# Altium project AMC_uBACKPLANE.PrjPcb (part 4 of 4)

## Sheet I2C_SW.SchDoc: I2C SW
size 420 x 297 mm; Organization: Altium Limited; Address1: L3, 12a Rodborough Rd; Address2: Frenchs Forest; Address3: NSW; Address4: Australia 2086; DocumentNumber: 14; SheetNumber: 15; SheetTotal: 15
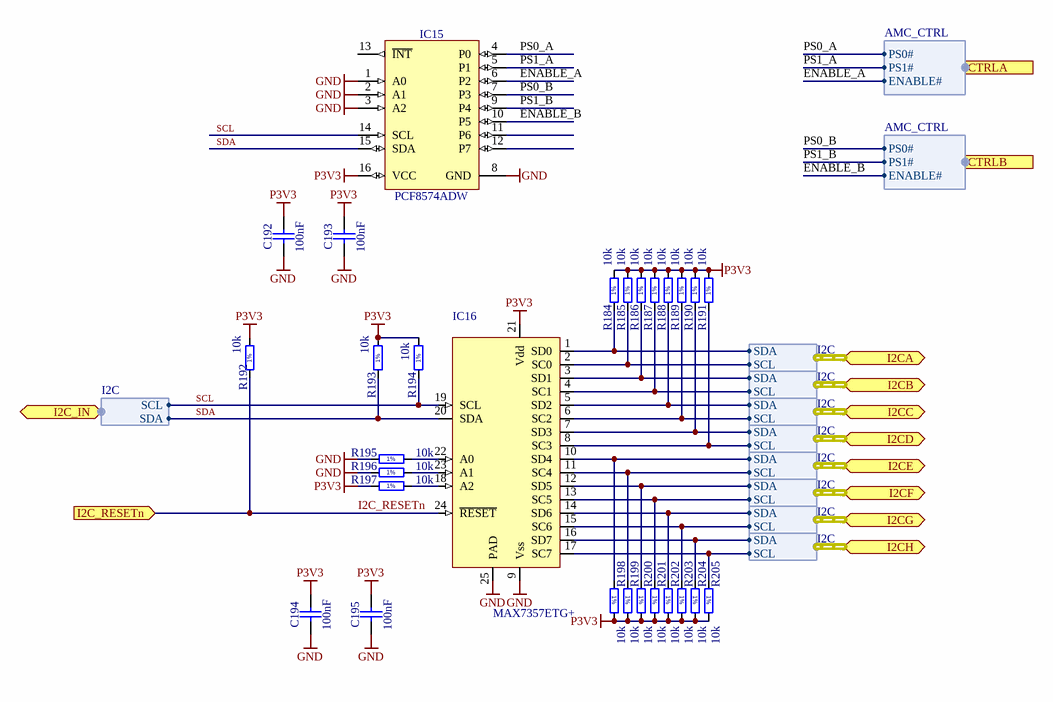
[diagram p14: I2C_SW.SchDoc]

### Parts
C192  100nF  [CAPC0603X33N]
C193  100nF  [CAPC0603X33N]
C194  100nF  [CAPC0603X33N]
C195  100nF  [CAPC0603X33N]
IC15  PCF8574ADW  [SOIC127P1030X265-16N]
IC16  MAX7357ETG+  [HVQFN24]
R184  10k  [RESC1005X40N]
R185  10k  [RESC1005X40N]
R186  10k  [RESC1005X40N]
R187  10k  [RESC1005X40N]
R188  10k  [RESC1005X40N]
R189  10k  [RESC1005X40N]
R190  10k  [RESC1005X40N]
R191  10k  [RESC1005X40N]
R192  10k  [RESC1005X40N]
R193  10k  [RESC1005X40N]
R194  10k  [RESC1005X40N]
R195  10k  [RESC1005X40N]
R196  10k  [RESC1005X40N]
R197  10k  [RESC1005X40N]
R198  10k  [RESC1005X40N]
R199  10k  [RESC1005X40N]
R200  10k  [RESC1005X40N]
R201  10k  [RESC1005X40N]
R202  10k  [RESC1005X40N]
R203  10k  [RESC1005X40N]
R204  10k  [RESC1005X40N]
R205  10k  [RESC1005X40N]

### Ports
CTRLA (harness AMC_CTRL), CTRLB (harness AMC_CTRL), I2C_IN (harness I2C), I2C_RESETn (in), I2CA (harness I2C), I2CB (harness I2C), I2CC (harness I2C), I2CD (harness I2C), I2CE (harness I2C), I2CF (harness I2C), I2CG (harness I2C), I2CH (harness I2C)

### Harnesses
I2C: SCL, SDA
AMC_CTRL: PS0#, PS1#, ENABLE#

### Nets
GND: C192.1 C193.1 C194.1 C195.1 IC15.1(A0) IC15.2(A1) IC15.3(A2) IC15.8(GND) IC16.9(Vss) IC16.25(PAD) R195.1 R196.1
P3V3: C192.2 C193.2 C194.2 C195.2 IC15.16(VCC) IC16.21(Vdd) R184.2 R185.2 R186.2 R187.2 R188.2 R189.2 R190.2 R191.2 R192.2 R193.2 R194.2 R197.1 R198.2 R199.2 R200.2 R201.2 R202.2 R203.2 R204.2 R205.2
ENABLE_A: IC15.6(P2) ; port CTRLA.ENABLE#  [project net CTRLA.ENABLE#]
ENABLE_B: IC15.10(P5) ; port CTRLB.ENABLE#  [project net CTRLB.ENABLE#]
I2C_RESETn: IC16.24(~{RESET}) R192.1 ; port I2C_RESETn  [project net I2C_RST]
IPMIA.SCL: IC16.8(SC3) R191.1 ; port I2CD.SCL
IPMIA.SDA: IC16.7(SD3) R190.1 ; port I2CD.SDA
IPMIB.SCL: IC16.17(SC7) R205.1 ; port I2CH.SCL
IPMIB.SDA: IC16.16(SD7) R204.1 ; port I2CH.SDA
PS0_A: IC15.4(P0) ; port CTRLA.PS0#  [project net CTRLA.PS0#]
PS0_B: IC15.7(P3) ; port CTRLB.PS0#  [project net CTRLB.PS0#]
PS1_A: IC15.5(P1) ; port CTRLA.PS1#  [project net CTRLA.PS1#]
PS1_B: IC15.9(P4) ; port CTRLB.PS1#  [project net CTRLB.PS1#]
QSPFA_BUS.SCL: IC16.2(SC0) R185.1 ; port I2CA.SCL
QSPFA_BUS.SDA: IC16.1(SD0) R184.1 ; port I2CA.SDA
QSPFB_BUS.SCL: IC16.13(SC5) R201.1 ; port I2CF.SCL
QSPFB_BUS.SDA: IC16.12(SD5) R200.1 ; port I2CF.SDA
SCL: IC15.14(SCL) IC16.19(SCL) R194.1 ; port I2C_IN.SCL  [project net CBUS.SCL]
SDA: IC15.15(SDA) IC16.20(SDA) R193.1 ; port I2C_IN.SDA  [project net CBUS.SDA]
SPFA0_BUS.SCL: IC16.4(SC1) R187.1 ; port I2CB.SCL
SPFA0_BUS.SDA: IC16.3(SD1) R186.1 ; port I2CB.SDA
SPFA1_BUS.SCL: IC16.11(SC4) R199.1 ; port I2CE.SCL
SPFA1_BUS.SDA: IC16.10(SD4) R198.1 ; port I2CE.SDA
SPFB0_BUS.SCL: IC16.15(SC6) R203.1 ; port I2CG.SCL
SPFB0_BUS.SDA: IC16.14(SD6) R202.1 ; port I2CG.SDA
SPFB1_BUS.SCL: IC16.6(SC2) R189.1 ; port I2CC.SCL
SPFB1_BUS.SDA: IC16.5(SD2) R188.1 ; port I2CC.SDA
NetIC16_18: IC16.18(A2) R197.2
NetIC16_22: IC16.22(A0) R195.2
NetIC16_23: IC16.23(A1) R196.2

Not connected (* = marked no-connect by the designer): IC15 11(P6) 12(P7) 13(~{INT})

### Notes on the sheet
- Project/Equipment
- Document
- uTCA RTM 8 SFP+
- Designer
- Drawn by
- Check.by
- Copyright Creotech Instruments SA 2014.
  This documentation describes Open Hardware and is licensed under the CERN OHL v.1.1. You may redistribute and modify this documentation under the terms of the CERN OHL v.1.1. (http://ohwr.org/CERNOHL). This documentation is distributed WITHOUT ANY EXPRESS OR IMPLIED WARRANTY, INCLUDING OF MERCHANTABILITY, SATISFACTORY QUALITY AND FITNESS FOR A PARTICULAR PURPOSE. Please see the CERN OHL v.1.1 for applicable conditions.
- Creotech Instruments S.A.
- File
- Last Mod.
- Print Date
- Sheet
- Size
- A3
- of
- Rev
- (in symbol R0402_10K_1%_0.0625W_100PPM) 1%

### Library data of the parts
C192-C195 = CC0201_100NF_6.3V_10%_X5R: as C74-C78 on sheet AMC; Part Number: CC0201_100NF_6.3V_10%_X5R; Component Kind: Standard; Component Type: Standard; Pin Count: 2; Value: 100nF; Status: Not Recommended; Manufacturer Part Number: CC0201_100NF_6.3V_10%_X5R; Case: 0201; Mounted: Yes; Socket: No; SMD: Yes; Manufacturer1 Example: AVX; Manufacturer1 ComponentHeight: 0.33mm; HelpURL: \\cern.ch\dfs\Applications\Altium\Datasheets\CC0201_X5R_AVX.pdf; Author: CERN DEM JLC; CreateDate: 2007-12-03; LatestRevisionDate: 2007-12-03
IC15 = PCF8574ADW: Remote 8-bit I/O Expander For I2C Bus; Manufacturer: TEXAS INSTRUMENTS; Table: Analog & Interface; Part Number: PCF8574ADW; Component Kind: Standard; Component Type: Standard; Device: PCF8574ADW; PackageDescription: SOIC 16, Pitch 1.27mm - Body 7.5x10.3mm, IPC Medium Density; Part Description: Remote 8-bit I/O Expander For I2C Bus; Manufacturer Part Number: PCF8574ADW; Pin Count: 16; Case: SOIC16W; Mounted: Yes; Socket: No; SMD: Yes; ComponentHeight: 2.65mm; Author: CERN DEM JLC; HelpURL: \\cern.ch\dfs\Applications\Altium\Datasheets\PCF8574ADW.pdf; CreateDate: 2012-11-01; LatestRevisionDate: 2012-11-01
IC16 = IIC_MUX_MAX7357ETG+: 8-channel I2C-bus multiplexer with reset, INT and timeout
R184-R205 = R0402_10K_1%_0.0625W_100PPM: Resistor - 1%; Part Description: General Purpose Thick Film Chip Resistor; Manufacturer: GENERIC; Manufacturer1 Part Number: 232270671003L; TC: ±100ppm/°C; Table: Resistors SMD; Part Number: R0402_10K_1%_0.0625W_100PPM; Component Kind: Standard; Component Type: Standard; Pin Count: 2; Value: 10k; Status: Not recommended; Power: 0.0625W; Tolerance: ±1%; Manufacturer Part Number: R0402_10K_1%_0.0625W_100PPM; Case: 0402; Mounted: Yes; Socket: No; SMD: Yes; Manufacturer1 Example: YAGEO PHYCOMP; Manufacturer1 ComponentHeight: 0.4mm; HelpURL: \\cern.ch\dfs\Applications\Altium\Datasheets\R0402_Phycomp_RC0402.pdf; Author: CERN DEM JLC; CreateDate: 2007-12-03; LatestRevisionDate: 2012-10-17

## Nets that join several sheets
GND: CPU (32 pins), QSFPA (22 pins), IO (86 pins), CLKs (40 pins), QSFPB (22 pins), SFPA1 (18 pins), ACC (68 pins), AFC (68 pins), SFPA0 (18 pins), SFPB1 (18 pins), SFPB0 (18 pins), UFL (16 pins), Supply (34 pins), USB_UART (11 pins), ETH_PHY (8 pins), ETH_CON (LED3.K LED4.K), MGT (11 pins), I2C_SW (12 pins)
GND_ETH: ETH_PHY (16 pins), ETH_CON (C173.1 C174.1)
GND_QSFP: QSFPA (14 pins), QSFPB (14 pins)
GND_SFP: SFPA1 (16 pins), SFPA0 (16 pins), SFPB1 (16 pins), SFPB0 (16 pins)
P3V3: CPU (31 pins), IO (51 pins), CLKs (C88.2 FB7.1), ACC (CON22A.4 R117A.2), AFC (CON22B.4 R117B.2), Supply (6 pins), ETH_PHY (8 pins), MGT (6 pins), I2C_SW (26 pins)
P3V3_REF: ACC (C78A.2 C79A.2 CON23A.2 R117A.1), AFC (C78B.2 C79B.2 CON23B.2 R117B.1)
P12V: Supply (13 pins), MGT (8 pins)
QSFP_P3V3: QSFPA (11 pins), QSFPB (11 pins), Supply (9 pins)
SFP_P3V3: SFPA1 (11 pins), SFPA0 (11 pins), SFPB1 (11 pins), SFPB0 (11 pins), Supply (9 pins)
ACC_A.CLK_N: ACC (CON22A.75), UFL (C109.1 C115.1)
ACC_A.CLK_P: ACC (CON22A.74), UFL (C113.1 C117.1)
ACC_B.CLK_N: ACC (CON22A.78), UFL (C121.1 C127.1)
ACC_B.CLK_P: ACC (CON22A.77), UFL (C125.1 C129.1)
ACC_C.CLK_N: ACC (CON22A.135), UFL (C133.1 C139.1)
ACC_C.CLK_P: ACC (CON22A.136), UFL (C137.1 C141.1)
ACC_D.CLK_N: ACC (CON22A.138), UFL (C145.1 C151.1)
ACC_D.CLK_P: ACC (CON22A.139), UFL (C149.1 C153.1)
AFC_A.CLK_N: AFC (CON22B.75), UFL (C106.1 C114.1)
AFC_A.CLK_P: AFC (CON22B.74), UFL (C110.1 C116.1)
AFC_B.CLK_N: AFC (CON22B.78), UFL (C118.1 C126.1)
AFC_B.CLK_P: AFC (CON22B.77), UFL (C122.1 C128.1)
AFC_C.CLK_N: AFC (CON22B.135), UFL (C130.1 C138.1)
AFC_C.CLK_P: AFC (CON22B.136), UFL (C134.1 C140.1)
AFC_D.CLK_N: AFC (CON22B.138), UFL (C142.1 C150.1)
AFC_D.CLK_P: AFC (CON22B.139), UFL (C146.1 C152.1)
AMC1_EN: CPU (IC6.39), Supply (R113.2 T4.1)
AMC1_P12V: AFC (8 pins), Supply (5 pins)
AMC2_EN: CPU (IC6.40), Supply (Q2.1 R114.2)
AMC2_P12V: ACC (8 pins), Supply (5 pins)
CBUS.SCL: CPU (IC6.47 IC7.6 R80.1), I2C_SW (IC15.14 IC16.19 R194.1)
CBUS.SDA: CPU (IC6.46 IC7.5 R78.1), I2C_SW (IC15.15 IC16.20 R193.1)
CLK0_N: CLKs (R131.2 R132.1), AFC (CON22B.81)
CLK0_P: CLKs (R129.2 R130.1), AFC (CON22B.80)
CLK1_N: CLKs (R138.2 R139.1), ACC (CON22A.81)
CLK1_P: CLKs (R136.2 R137.1), ACC (CON22A.80)
CLK_EN: CPU (IC6.7), CLKs (OSC1.1 R128.1)
CLK_SEL: CPU (IC6.6), CLKs (R124.1)
CTRLA.ENABLE#: AFC (CON22B.41), I2C_SW (IC15.6)
CTRLA.PS0#: AFC (CON22B.83), I2C_SW (IC15.4)
CTRLA.PS1#: AFC (CON22B.3), I2C_SW (IC15.5)
CTRLB.ENABLE#: ACC (CON22A.41), I2C_SW (IC15.10)
CTRLB.PS0#: ACC (CON22A.83), I2C_SW (IC15.7)
CTRLB.PS1#: ACC (CON22A.3), I2C_SW (IC15.9)
FP2A.RX1_N: ACC (CON22A.90), AFC (CON22B.87)
FP2A.RX1_P: ACC (CON22A.91), AFC (CON22B.88)
FP2A.RX2_N: ACC (CON22A.96), AFC (CON22B.93)
FP2A.RX2_P: ACC (CON22A.97), AFC (CON22B.94)
FP2A.RX3_N: ACC (CON22A.102), AFC (CON22B.99)
FP2A.RX3_P: ACC (CON22A.103), AFC (CON22B.100)
FP2A.RX4_N: ACC (CON22A.108), AFC (CON22B.105)
FP2A.RX4_P: ACC (CON22A.109), AFC (CON22B.106)
FP2A.TX1_N: ACC (CON22A.87), AFC (CON22B.90)
FP2A.TX1_P: ACC (CON22A.88), AFC (CON22B.91)
FP2A.TX2_N: ACC (CON22A.93), AFC (CON22B.96)
FP2A.TX2_P: ACC (CON22A.94), AFC (CON22B.97)
FP2A.TX3_N: ACC (CON22A.99), AFC (CON22B.102)
FP2A.TX3_P: ACC (CON22A.100), AFC (CON22B.103)
FP2A.TX4_N: ACC (CON22A.105), AFC (CON22B.108)
FP2A.TX4_P: ACC (CON22A.106), AFC (CON22B.109)
FP_QSFPA.RX1_N: QSFPA (CON18A.18), AFC (CON22B.48)
FP_QSFPA.RX1_P: QSFPA (CON18A.17), AFC (CON22B.47)
FP_QSFPA.RX2_N: QSFPA (CON18A.21), AFC (CON22B.54)
FP_QSFPA.RX2_P: QSFPA (CON18A.22), AFC (CON22B.53)
FP_QSFPA.RX3_N: QSFPA (CON18A.15), AFC (CON22B.63)
FP_QSFPA.RX3_P: QSFPA (CON18A.14), AFC (CON22B.62)
FP_QSFPA.RX4_N: QSFPA (CON18A.24), AFC (CON22B.69)
FP_QSFPA.RX4_P: QSFPA (CON18A.25), AFC (CON22B.68)
FP_QSFPA.TX1_N: QSFPA (CON18A.37), AFC (CON22B.45)
FP_QSFPA.TX1_P: QSFPA (CON18A.36), AFC (CON22B.44)
FP_QSFPA.TX2_N: QSFPA (CON18A.2), AFC (CON22B.51)
FP_QSFPA.TX2_P: QSFPA (CON18A.3), AFC (CON22B.50)
FP_QSFPA.TX3_N: QSFPA (CON18A.34), AFC (CON22B.60)
FP_QSFPA.TX3_P: QSFPA (CON18A.33), AFC (CON22B.59)
FP_QSFPA.TX4_N: QSFPA (CON18A.5), AFC (CON22B.66)
FP_QSFPA.TX4_P: QSFPA (CON18A.6), AFC (CON22B.65)
FP_QSFPB.RX1_N: QSFPB (CON18B.18), ACC (CON22A.48)
FP_QSFPB.RX1_P: QSFPB (CON18B.17), ACC (CON22A.47)
FP_QSFPB.RX2_N: QSFPB (CON18B.21), ACC (CON22A.54)
FP_QSFPB.RX2_P: QSFPB (CON18B.22), ACC (CON22A.53)
FP_QSFPB.RX3_N: QSFPB (CON18B.15), ACC (CON22A.63)
FP_QSFPB.RX3_P: QSFPB (CON18B.14), ACC (CON22A.62)
FP_QSFPB.RX4_N: QSFPB (CON18B.24), ACC (CON22A.69)
FP_QSFPB.RX4_P: QSFPB (CON18B.25), ACC (CON22A.68)
FP_QSFPB.TX1_N: QSFPB (CON18B.37), ACC (CON22A.45)
FP_QSFPB.TX1_P: QSFPB (CON18B.36), ACC (CON22A.44)
FP_QSFPB.TX2_N: QSFPB (CON18B.2), ACC (CON22A.51)
FP_QSFPB.TX2_P: QSFPB (CON18B.3), ACC (CON22A.50)
FP_QSFPB.TX3_N: QSFPB (CON18B.34), ACC (CON22A.60)
FP_QSFPB.TX3_P: QSFPB (CON18B.33), ACC (CON22A.59)
FP_QSFPB.TX4_N: QSFPB (CON18B.5), ACC (CON22A.66)
FP_QSFPB.TX4_P: QSFPB (CON18B.6), ACC (CON22A.65)
I2C_RST: CPU (IC6.48 R82.1), I2C_SW (IC16.24 R192.1)
IPMIA.SCL: AFC (CON22B.56), I2C_SW (IC16.8 R191.1)
IPMIA.SDA: AFC (CON22B.71), I2C_SW (IC16.7 R190.1)
IPMIB.SCL: ACC (CON22A.56), I2C_SW (IC16.17 R205.1)
IPMIB.SDA: ACC (CON22A.71), I2C_SW (IC16.16 R204.1)
MBUS.SCL: CPU (IC6.24 R85.1), IO (IC1.14), MGT (IC12.16)
MBUS.SDA: CPU (IC6.25 R86.1), IO (IC1.15), MGT (IC12.15)
MGT.FANn: CPU (IC6.29), MGT (IC12.5 R158.2)
MGT.OVERn: CPU (IC6.33), MGT (IC12.14 R157.2)
MGT.THERMn: CPU (IC6.32), MGT (IC12.6 R156.2)
MLVDS.Rx17_N: IO (CON12.2 IC4.14 R20.1), ACC (CON22A.141), AFC (CON22B.141)
MLVDS.Rx17_P: IO (CON12.1 IC4.13 R20.2), ACC (CON22A.142), AFC (CON22B.142)
MLVDS.Rx18_N: IO (CON10.2 IC4.4 R24.1), ACC (CON22A.147), AFC (CON22B.147)
MLVDS.Rx18_P: IO (CON10.1 IC4.3 R24.2), ACC (CON22A.148), AFC (CON22B.148)
MLVDS.Rx19_N: IO (CON16.2 IC5.14 R27.1), ACC (CON22A.153), AFC (CON22B.153)
MLVDS.Rx19_P: IO (CON16.1 IC5.13 R27.2), ACC (CON22A.154), AFC (CON22B.154)
MLVDS.Rx20_N: IO (CON14.2 IC5.4 R30.1), ACC (CON22A.159), AFC (CON22B.159)
MLVDS.Rx20_P: IO (CON14.1 IC5.3 R30.2), ACC (CON22A.160), AFC (CON22B.160)
MLVDS.Tx17_N: IO (CON11.2 IC4.10 R22.2), ACC (CON22A.144), AFC (CON22B.144)
MLVDS.Tx17_P: IO (CON11.1 IC4.9 R22.1), ACC (CON22A.145), AFC (CON22B.145)
MLVDS.Tx18_N: IO (CON9.2 IC4.48 R25.2), ACC (CON22A.150), AFC (CON22B.150)
MLVDS.Tx18_P: IO (CON9.1 IC4.47 R25.1), ACC (CON22A.151), AFC (CON22B.151)
MLVDS.Tx19_N: IO (CON15.2 IC5.10 R29.2), ACC (CON22A.156), AFC (CON22B.156)
MLVDS.Tx19_P: IO (CON15.1 IC5.9 R29.1), ACC (CON22A.157), AFC (CON22B.157)
MLVDS.Tx20_N: IO (CON13.2 IC5.48 R32.2), ACC (CON22A.162), AFC (CON22B.162)
MLVDS.Tx20_P: IO (CON13.1 IC5.47 R32.1), ACC (CON22A.163), AFC (CON22B.163)
P0A_SFP.Rx_N: AFC (CON22B.15), SFPA0 (CON19B.12)
P0A_SFP.Rx_P: AFC (CON22B.14), SFPA0 (CON19B.13)
P0A_SFP.Tx_N: AFC (CON22B.12), SFPA0 (CON19B.19)
P0A_SFP.Tx_P: AFC (CON22B.11), SFPA0 (CON19B.18)
P0B_SFP.Rx_N: ACC (CON22A.15), SFPB0 (CON19D.12)
P0B_SFP.Rx_P: ACC (CON22A.14), SFPB0 (CON19D.13)
P0B_SFP.Tx_N: ACC (CON22A.12), SFPB0 (CON19D.19)
P0B_SFP.Tx_P: ACC (CON22A.11), SFPB0 (CON19D.18)
P1A.Rx_N: AFC (CON22B.24), CrossPort (C156.2 C164.2)
P1A.Rx_P: AFC (CON22B.23), CrossPort (C154.2 C162.2)
P1A.Tx_N: AFC (CON22B.21), CrossPort (C160.2 C168.2)
P1A.Tx_P: AFC (CON22B.20), CrossPort (C158.2 C166.2)
P1A_SFP.Rx_N: SFPA1 (CON19A.12), CrossPort (C156.1)
P1A_SFP.Rx_P: SFPA1 (CON19A.13), CrossPort (C154.1)
P1A_SFP.Tx_N: SFPA1 (CON19A.19), CrossPort (C160.1)
P1A_SFP.Tx_P: SFPA1 (CON19A.18), CrossPort (C158.1)
P1B.Rx_N: ACC (CON22A.24), CrossPort (C157.1 C165.1)
P1B.Rx_P: ACC (CON22A.23), CrossPort (C155.1 C163.1)
P1B.Tx_N: ACC (CON22A.21), CrossPort (C161.1 C169.1)
P1B.Tx_P: ACC (CON22A.20), CrossPort (C159.1 C167.1)
P1B_SFP.Rx_N: SFPB1 (CON19C.12), CrossPort (C157.2)
P1B_SFP.Rx_P: SFPB1 (CON19C.13), CrossPort (C155.2)
P1B_SFP.Tx_N: SFPB1 (CON19C.19), CrossPort (C161.2)
P1B_SFP.Tx_P: SFPB1 (CON19C.18), CrossPort (C159.2)
QSFPA.INTL: CPU (R75.1), QSFPA (CON18A.28 R90A.1)
QSFPA.LPM: CPU (R74.1), QSFPA (CON18A.31)
QSFPA.MPRS: CPU (R76.1), QSFPA (CON18A.27 R91A.1)
QSFPA.MSEL: CPU (R72.1), QSFPA (CON18A.8 R89A.1)
QSFPA.RST: CPU (R73.1), QSFPA (CON18A.9)
QSFPB.INTL: CPU (R83.1), QSFPB (CON18B.28 R90B.1)
QSFPB.LPM: CPU (R81.1), QSFPB (CON18B.31)
QSFPB.MPRS: CPU (R87.1), QSFPB (CON18B.27 R91B.1)
QSFPB.MSEL: CPU (R77.1), QSFPB (CON18B.8 R89B.1)
QSFPB.RST: CPU (R79.1), QSFPB (CON18B.9)
QSPFA_BUS.SCL: QSFPA (CON18A.11), I2C_SW (IC16.2 R185.1)
QSPFA_BUS.SDA: QSFPA (CON18A.12), I2C_SW (IC16.1 R184.1)
QSPFB_BUS.SCL: QSFPB (CON18B.11), I2C_SW (IC16.13 R201.1)
QSPFB_BUS.SDA: QSFPB (CON18B.12), I2C_SW (IC16.12 R200.1)
RJ45.LED_GRN: ETH_PHY (IC14.3 R180.2), ETH_CON (R165.1)
RJ45.LED_YEL: ETH_PHY (IC14.2 R181.2), ETH_CON (R170.1)
RJ45.TD_N: ETH_PHY (C185.2 IC14.20 R172.1), ETH_CON (TR2.3)
RJ45.TD_P: ETH_PHY (C184.2 IC14.21 R173.1), ETH_CON (TR2.1)
RMII.MDC: CPU (IC6.87), ETH_PHY (IC14.13)
RMII.MDIO: CPU (IC6.86), ETH_PHY (IC14.12 R171.1)
RMII.RX_DV: CPU (IC6.92), ETH_PHY (IC14.11 R176.1)
RMII.RX_ER: CPU (IC6.89), ETH_PHY (IC14.10 R179.2)
RMII.RXD0: CPU (IC6.91), ETH_PHY (IC14.8 R174.1)
RMII.RXD1: CPU (IC6.90), ETH_PHY (IC14.7 R175.1)
RMII.TX_CLK: CPU (IC6.88), ETH_PHY (IC14.14)
RMII.TX_EN: CPU (IC6.93), ETH_PHY (IC14.16)
RMII.TXD0: CPU (IC6.95), ETH_PHY (IC14.17)
RMII.TXD1: CPU (IC6.94), ETH_PHY (IC14.18)
RSTO: CPU (IC6.14), ETH_PHY (IC14.15)
SFPA0.LED1: CPU (R36.1), SFPA0 (R97B.2 T1B.1)
SFPA0.LED2: CPU (R42.1), SFPA0 (R99B.2 T2B.1)
SFPA0.LOS: CPU (R41.1), SFPA0 (CON19B.8 R94B.1)
SFPA0.MODDEF0: CPU (R40.1), SFPA0 (CON19B.6 R93B.1)
SFPA0.RS0: CPU (R37.1), SFPA0 (CON19B.7)
SFPA0.RS1: CPU (R38.1), SFPA0 (R95B.2)
SFPA0.TXDISABLE: CPU (R35.1), SFPA0 (CON19B.3)
SFPA0.TXFAULT: CPU (R39.1), SFPA0 (CON19B.2 R92B.1)
SFPA1.LED1: CPU (R45.1), SFPA1 (R97A.2 T1A.1)
SFPA1.LED2: CPU (R51.1), SFPA1 (R99A.2 T2A.1)
SFPA1.LOS: CPU (R50.1), SFPA1 (CON19A.8 R94A.1)
SFPA1.MODDEF0: CPU (R49.1), SFPA1 (CON19A.6 R93A.1)
SFPA1.RS0: CPU (R46.1), SFPA1 (CON19A.7)
SFPA1.RS1: CPU (R47.1), SFPA1 (R95A.2)
SFPA1.TXDISABLE: CPU (R44.1), SFPA1 (CON19A.3)
SFPA1.TXFAULT: CPU (R48.1), SFPA1 (CON19A.2 R92A.1)
SFPB0.LED1: CPU (R53.1), SFPB0 (R97D.2 T1D.1)
SFPB0.LED2: CPU (R62.1), SFPB0 (R99D.2 T2D.1)
SFPB0.LOS: CPU (R61.1), SFPB0 (CON19D.8 R94D.1)
SFPB0.MODDEF0: CPU (R60.1), SFPB0 (CON19D.6 R93D.1)
SFPB0.RS0: CPU (R55.1), SFPB0 (CON19D.7)
SFPB0.RS1: CPU (R57.1), SFPB0 (R95D.2)
SFPB0.TXDISABLE: CPU (R52.1), SFPB0 (CON19D.3)
SFPB0.TXFAULT: CPU (R59.1), SFPB0 (CON19D.2 R92D.1)
SFPB1.LED1: CPU (R65.1), SFPB1 (R97C.2 T1C.1)
SFPB1.LED2: CPU (R71.1), SFPB1 (R99C.2 T2C.1)
SFPB1.LOS: CPU (R70.1), SFPB1 (CON19C.8 R94C.1)
SFPB1.MODDEF0: CPU (R69.1), SFPB1 (CON19C.6 R93C.1)
SFPB1.RS0: CPU (R66.1), SFPB1 (CON19C.7)
SFPB1.RS1: CPU (R67.1), SFPB1 (R95C.2)
SFPB1.TXDISABLE: CPU (R64.1), SFPB1 (CON19C.3)
SFPB1.TXFAULT: CPU (R68.1), SFPB1 (CON19C.2 R92C.1)
SPFA0_BUS.SCL: SFPA0 (CON19B.5), I2C_SW (IC16.4 R187.1)
SPFA0_BUS.SDA: SFPA0 (CON19B.4), I2C_SW (IC16.3 R186.1)
SPFA1_BUS.SCL: SFPA1 (CON19A.5), I2C_SW (IC16.11 R199.1)
SPFA1_BUS.SDA: SFPA1 (CON19A.4), I2C_SW (IC16.10 R198.1)
SPFB0_BUS.SCL: SFPB0 (CON19D.5), I2C_SW (IC16.15 R203.1)
SPFB0_BUS.SDA: SFPB0 (CON19D.4), I2C_SW (IC16.14 R202.1)
SPFB1_BUS.SCL: SFPB1 (CON19C.5), I2C_SW (IC16.6 R189.1)
SPFB1_BUS.SDA: SFPB1 (CON19C.4), I2C_SW (IC16.5 R188.1)
UART.RXD: CPU (IC6.85), USB_UART (R163.1)
UART.TXD: CPU (IC6.82), USB_UART (R164.1)